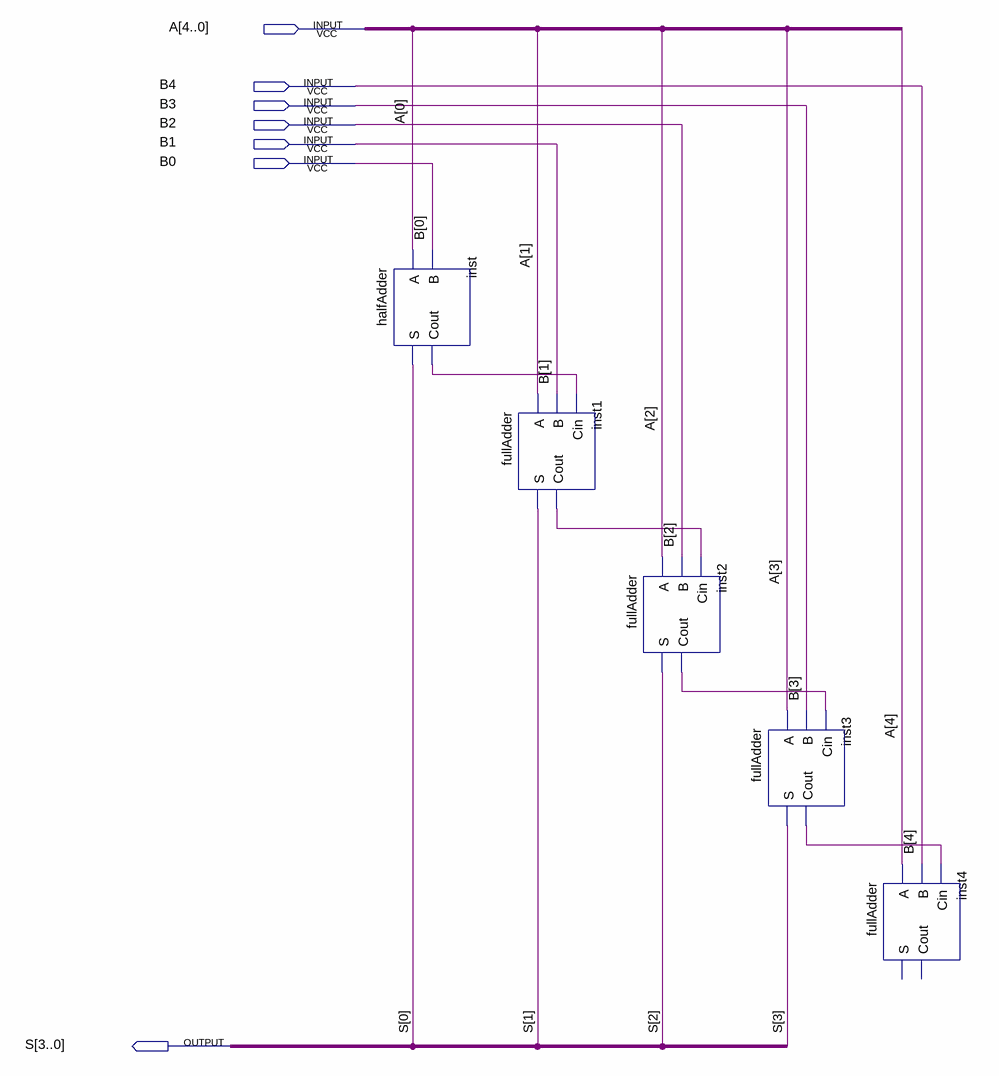
[diagram p0: schematic sheet]
// Quartus schematic adder_5bits.bdf as structural Verilog: 5 symbols, 7 pins
module adder_5bits (
  input  [4:0] A,
  input  B4,
  input  B3,
  input  B2,
  input  B1,
  input  B0,
  output [3:0] S
);

  wire inst1_cout, inst2_cout, inst3_cout, inst_cout;

  halfAdder inst (.A(A[0]), .B(B0), .S(S[0]), .Cout(inst_cout));
  fullAdder inst1 (.A(A[1]), .B(B1), .Cin(inst_cout), .S(S[1]), .Cout(inst1_cout));
  fullAdder inst2 (.A(A[2]), .B(B2), .Cin(inst1_cout), .S(S[2]), .Cout(inst2_cout));
  fullAdder inst3 (.A(A[3]), .B(B3), .Cin(inst2_cout), .S(S[3]), .Cout(inst3_cout));
  fullAdder inst4 (.A(A[4]), .B(B4), .Cin(inst3_cout));  // open: S, Cout
endmodule
